# EAGLE schematic untitled (EAGLE 7.6.0)
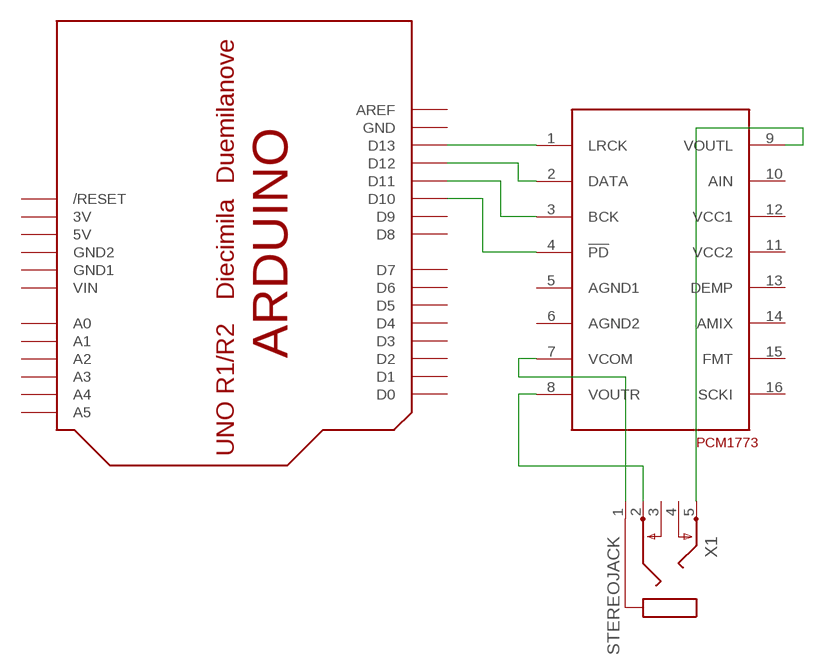
[diagram p0: schematic, sheet 1]

## Parts
U$1  ARDUINO-NOHOLE  [ARDUINO-NOHOLE]
U$2  PCM1773  [TSSOP16]
X1  STEREOJACK  [STX3100]

## Nets
N$1: U$1.D13 U$2.1(LRCK)
N$2: U$1.D12 U$2.2(DATA)
N$3: U$1.D11 U$2.3(BCK)
N$4: U$1.D10 U$2.4(!PD)
N$6: U$2.7(VCOM) X1.1
N$7: U$2.8(VOUTR) X1.2
N$8: U$2.9(VOUTL) X1.5
Unconnected: U$1.A0 U$1.A1 U$1.A2 U$1.A3 U$1.A4 U$1.A5 U$1.AREF U$1.D0 U$1.D1 U$1.D2 U$1.D3 U$1.D4 U$1.D5 U$1.D6 U$1.D7 U$1.D8 U$1.D9 U$1.RESET(/RESET) U$2.10(AIN) U$2.13(DEMP) U$2.14(AMIX) U$2.15(FMT) U$2.16(SCKI) X1.3 X1.4

## Power pins joined to a net without a drawn wire
3V: U$1.3V
5V: U$1.5V
AGND1: U$2.5(AGND1)
AGND2: U$2.6(AGND2)
GND: U$1.GND
GND1: U$1.GND1
GND2: U$1.GND2
VCC1: U$2.12(VCC1)
VCC2: U$2.11(VCC2)
VIN: U$1.VIN

## Library data of the parts
U$1 = adafruit:ARDUINO: Arduino Diecimila/Duemilanove Make a shield with ease, this package has all the named pins as well as the two mounting drill holes and an outline of the USB and DC power connector. The outline is on the DIMENSION layer, so if your board house uses it they will cut the outline to match. http://www.ladyada.net/library/pcb/eaglelibrary.html
U$2 = PCM1773:PCM1773
X1 = adafruit:STEREOJACK: MIC/HEADPHONE JACK Stereo jack with two switches. Kycon STX3100, CUI SJ1-3555NG and/or 4UCon 05544